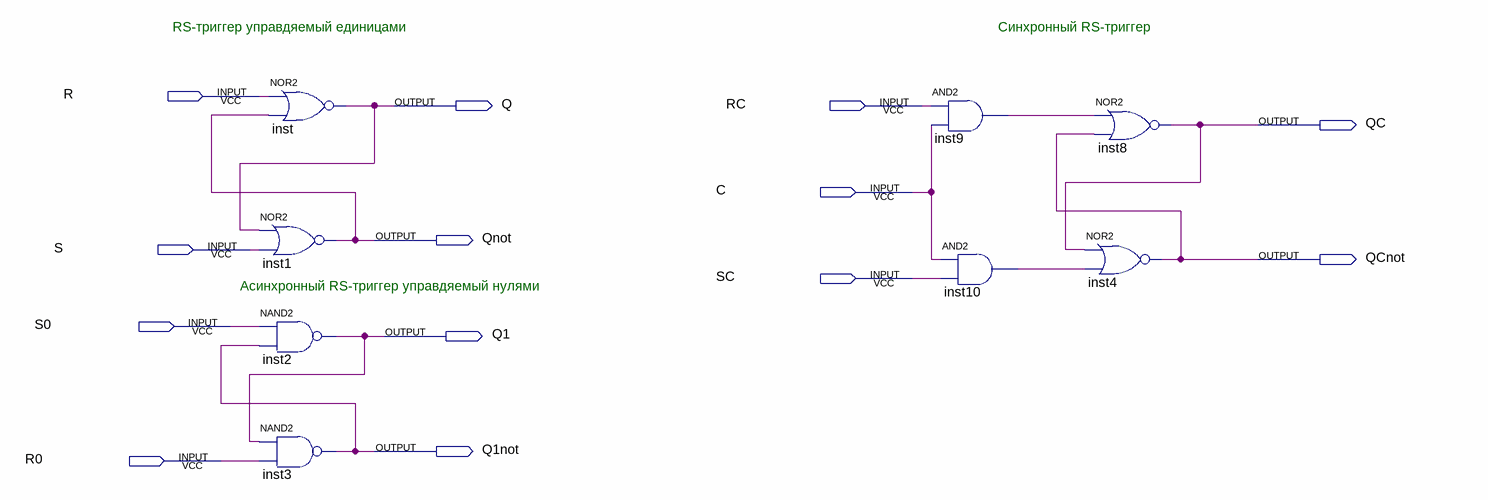
[diagram p0: schematic sheet]
// Quartus schematic RS-trigger.bdf as structural Verilog: 8 symbols, 13 pins
module \RS-trigger  (
  input  R,
  input  RC,
  input  C,
  input  S,
  input  SC,
  input  S0,
  input  R0,
  output Q,
  output QC,
  output Qnot,
  output QCnot,
  output Q1,
  output Q1not
);

  wire inst9_out, inst10_out;

  nor inst (Q, R, Qnot);
  nor inst1 (Qnot, Q, S);
  nand inst2 (Q1, S0, Q1not);
  nand inst3 (Q1not, Q1, R0);
  and inst9 (inst9_out, RC, C);
  and inst10 (inst10_out, C, SC);
  nor inst8 (QC, inst9_out, QCnot);
  nor inst4 (QCnot, QC, inst10_out);

  // Notes on the sheet:
  //   RS-триггер управдяемый единицами
  //   Синхронный RS-триггер
  //   Асинхронный RS-триггер управдяемый нулями
endmodule
